# EAGLE design ehomeShades_doit_v2 (EAGLE 8.7.0)
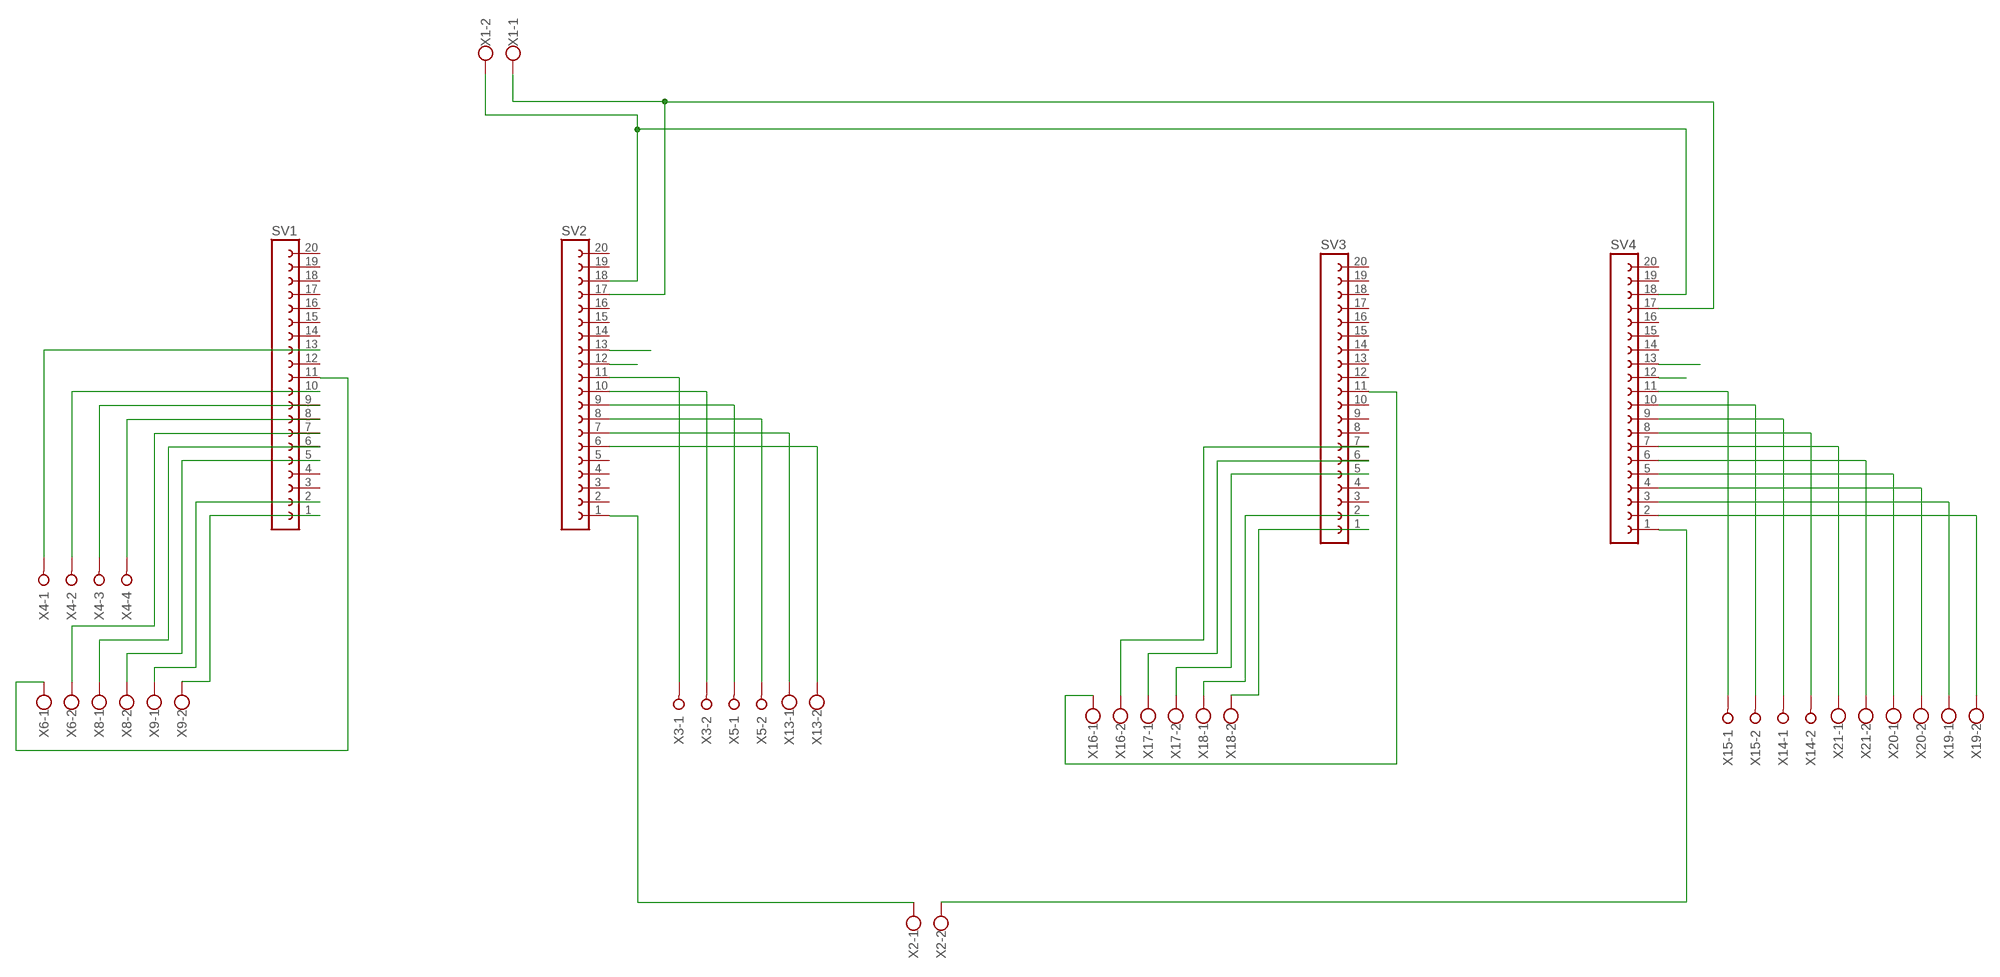
[diagram p0: schematic, sheet 1]

## Parts
SV1  FE20-1  [FE20]
SV2  FE20-1  [FE20]
SV3  FE20-1  [FE20]
SV4  FE20-1  [FE20]
X1  W237-102  [W237-102]
X2  W237-102  [W237-102]
X3  W237-02P  [W237-132]
X4  W237-04P  [W237-4P]
X5  W237-02P  [W237-132]
X6  W237-102  [W237-102]
X8  W237-102  [W237-102]
X9  W237-102  [W237-102]
X13  W237-102  [W237-102]
X14  W237-02P  [W237-132]
X15  W237-02P  [W237-132]
X16  W237-102  [W237-102]
X17  W237-102  [W237-102]
X18  W237-102  [W237-102]
X19  W237-102  [W237-102]
X20  W237-102  [W237-102]
X21  W237-102  [W237-102]

## Nets
EN: SV2.1 X2.1
EN1: SV4.1 X2.2
GND: SV2.17 SV4.17 X1.1
GPIO1: SV4.8 X14.2
GPIO2: SV4.2 X19.2
GPIO3: SV4.3 X19.1
GPIO4: SV1.11 X6.1
GPIO5: SV1.8 X4.4
GPIO6: SV4.4 X20.2
GPIO7: SV4.5 X20.1
GPIO8: SV4.6 X21.2
GPIO9: SV4.7 X21.1
GPIO12: SV2.12
GPIO13: SV2.13
GPIO14: SV2.11 X3.1
GPIO15: SV1.13 X4.1
GPIO16: SV1.10 X4.2
GPIO17: SV1.9 X4.3
GPIO18: SV1.7 X6.2
GPIO19: SV1.6 X8.1
GPIO20: SV3.7 X16.2
GPIO21: SV1.5 X8.2
GPIO22: SV1.2 X9.1
GPIO23: SV1.1 X9.2
GPIO24: SV3.6 X17.1
GPIO25: SV2.8 X5.2
GPIO26: SV2.9 X5.1
GPIO27: SV2.10 X3.2
GPIO28: SV4.9 X14.1
GPIO29: SV4.10 X15.2
GPIO30: SV4.11 X15.1
GPIO31: SV4.13
GPIO32: SV2.6 X13.2
GPIO33: SV2.7 X13.1
GPIO40: SV3.5 X17.2
GPIO41: SV3.2 X18.1
GPIO42: SV3.1 X18.2
GPIO43: SV3.11 X16.1
GPIO44: SV4.12
PWR: SV2.18 SV4.18 X1.2
Unconnected: SV1.3 SV1.4 SV1.12 SV1.14 SV1.15 SV1.16 SV1.17 SV1.18 SV1.19 SV1.20 SV2.2 SV2.3 SV2.4 SV2.5 SV2.14 SV2.15 SV2.16 SV2.19 SV2.20 SV3.3 SV3.4 SV3.8 SV3.9 SV3.10 SV3.12 SV3.13 SV3.14 SV3.15 SV3.16 SV3.17 SV3.18 SV3.19 SV3.20 SV4.14 SV4.15 SV4.16 SV4.19 SV4.20

## Library data of the parts
SV1-SV4 = con-lsta:FE20-1: FEMALE HEADER; OC_FARNELL: unknown; OC_NEWARK: unknown
X1 X2 X6 X8 X9 X13 X16-X21 = con-wago-500:W237-102: WAGO SCREW CLAMP; MPN: 237-102; OC_FARNELL: unknown; OC_NEWARK: 70K9898
X3 X5 X14 X15 = con-wago-508:W237-02P: WAGO SREW CLAMP; OC_FARNELL: unknown; OC_NEWARK: unknown
X4 = con-wago-508:W237-04P: WAGO SREW CLAMP; OC_FARNELL: unknown; OC_NEWARK: unknown

## Board
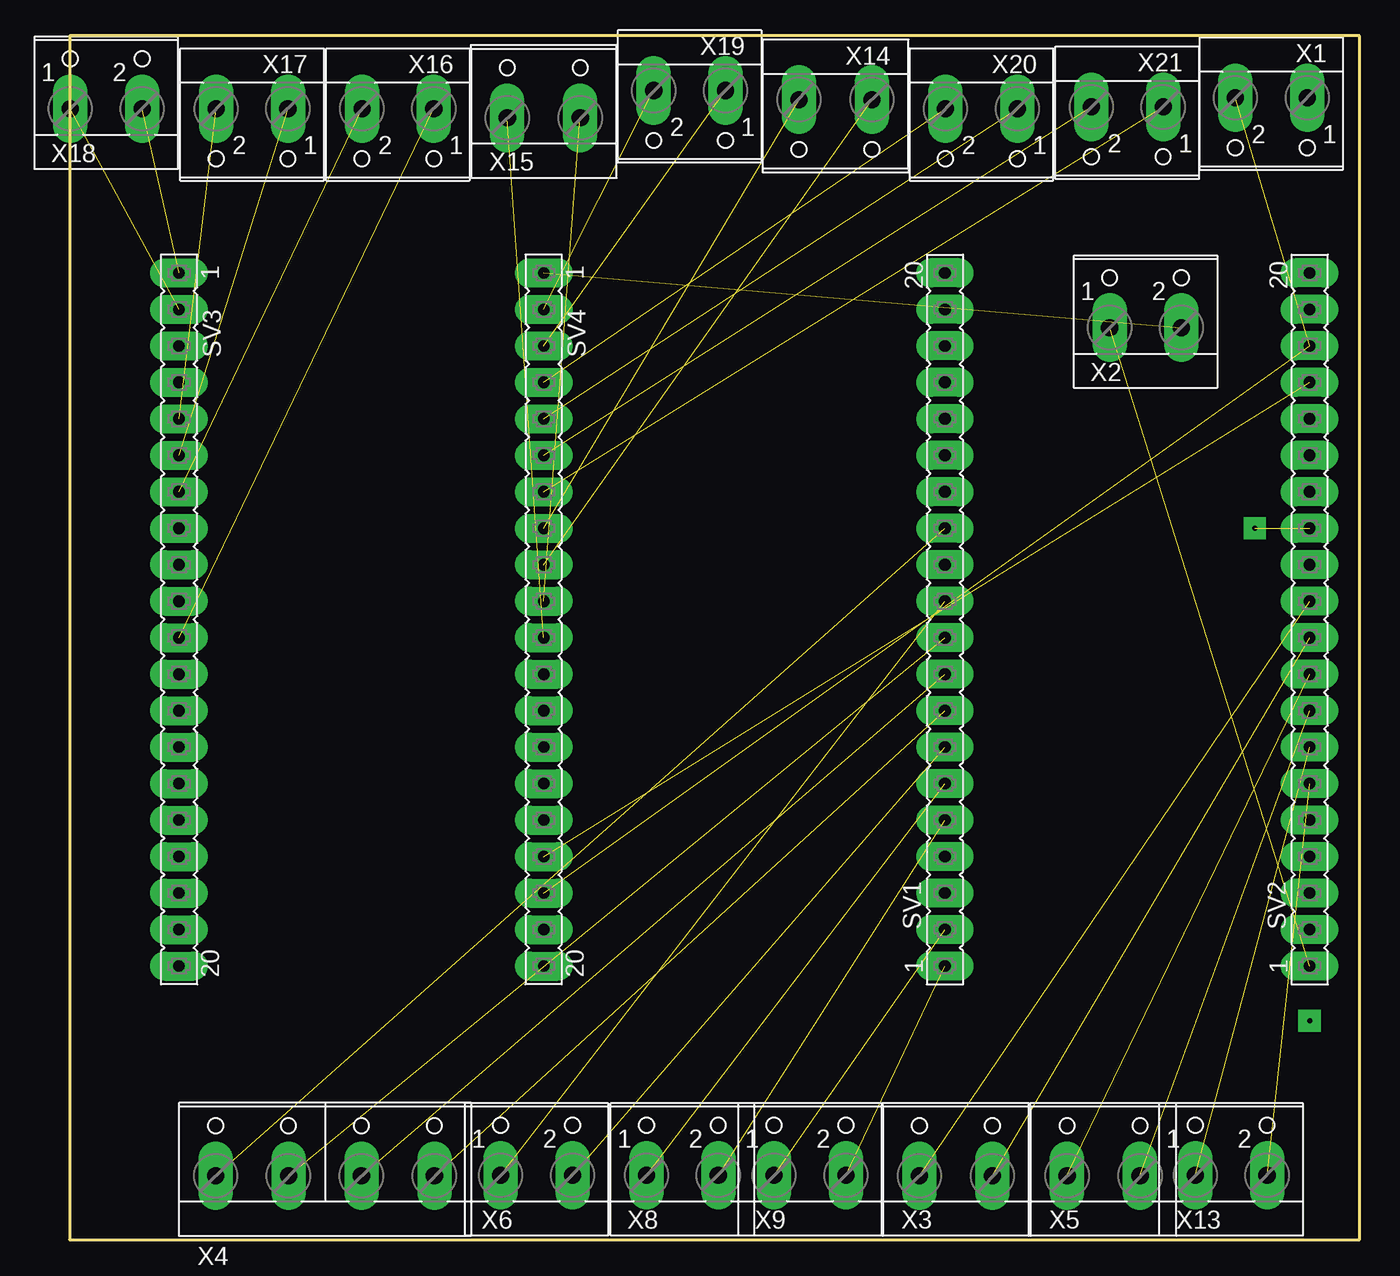
[diagram p1: board, top side]
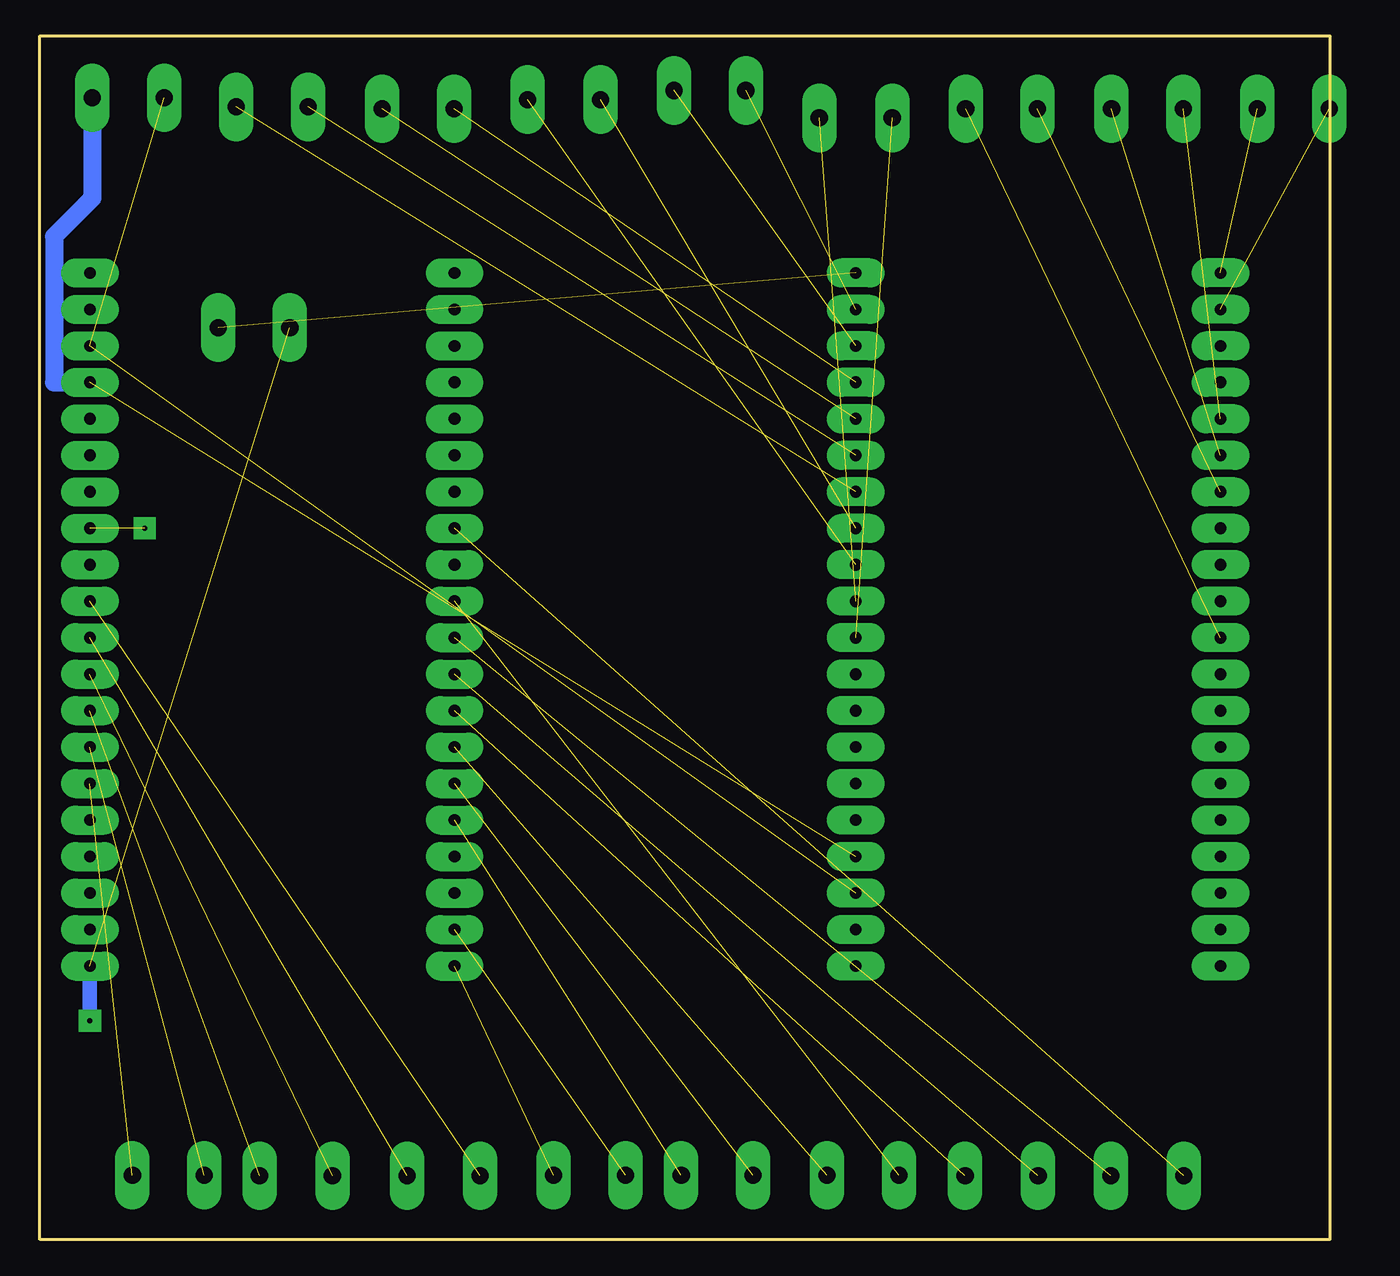
[diagram p2: board, bottom side, seen from below]

Size 89.84 x 83.81 mm. Coordinates in mm from the lower left corner, seen from the top.
Outline: 0,0 89.84,0 89.84,83.81 0,83.81 0,0
Copper layers (1*16): Top 0.035mm / dielectric 1.5mm / Bottom 0.035mm
Design rules "hobby *": minimum track width 1mm, minimum drill 1mm, track to track 0.8mm, track to pad 0.8mm, pad to pad 0.45mm, via to via 0.8mm, smd to smd 8mil, copper to edge 10mil, drill to drill 8mil, minimum pad ring 0.6mm, minimum via ring 0.6mm, stop-mask expansion 0mil, vias tented up to drill 0mil, thermal gap 10mil

### Footprints (pad centres in the part's own frame; a part is rotated, then mirrored left to right if it is on the bottom)
FE20 = drill 0.813 long: 1 -24.13,0; 2 -21.59,0; 3 -19.05,0; 4 -16.51,0; 5 -13.97,0; 6 -11.43,0; 7 -8.89,0; 8 -6.35,0; 9 -3.81,0; 10 -1.27,0; 11 1.27,0; 12 3.81,0; 13 6.35,0; 14 8.89,0; 15 11.43,0; 16 13.97,0; 17 16.51,0; 18 19.05,0; 19 21.59,0; 20 24.13,0
W237-102 = drill 1.194 long: 1 -2.5,-1.27; 2 2.5,-1.27
W237-132 = drill 1.194 long: 1 -2.54,-0.635; 2 2.54,-0.635
W237-4P = drill 1.194 long: 1 -7.62,-0.635; 2 -2.54,-0.635; 3 2.54,-0.635; 4 7.62,-0.635

### Placement (x,y rotation side)
SV1  60.96,43.18 90 top
SV2  86.36,43.18 90 top
SV3  7.62,43.18 270 top
SV4  33.02,43.18 270 top
X1  83.69,78.23 180 top
X2  74.93,64.77 0 top
X3  61.72,5.08 0 top
X4  17.78,5.08 0 top
X5  72.01,5.08 0 top
X6  32.51,5.75 0 top
X8  42.67,5.75 0 top
X9  51.56,5.75 0 top
X13  80.9,5.75 0 top
X14  53.34,78.74 180 top
X15  33.02,78.74 0 top
X16  22.86,77.47 180 top
X17  12.7,77.47 180 top
X18  2.54,80.01 0 top
X19  43.18,78.74 180 top
X20  63.5,77.47 180 top
X21  73.66,77.6 180 top

### Tracks (layer width: path | path; a pad name or v marks a point on that pad's centre or on a via)
EN  (via drill 0.35)  (1 unrouted)
  Bottom 1.016: v86.36,15.24 SV2.1
EN1  (1 unrouted)
GND  (1 unrouted)
  Bottom 1.27: X1.1 86.19,72.51 88.85,69.85 88.85,59.69 SV2.17
GPIO1  (1 unrouted)
GPIO2  (1 unrouted)
GPIO3  (1 unrouted)
GPIO4  (1 unrouted)
GPIO5  (1 unrouted)
GPIO6  (1 unrouted)
GPIO7  (1 unrouted)
GPIO8  (1 unrouted)
GPIO9  (1 unrouted)
GPIO13  (via drill 0.35)  (1 unrouted)
  other vias: 82.55,49.53
GPIO14  (1 unrouted)
GPIO15  (1 unrouted)
GPIO16  (1 unrouted)
GPIO17  (1 unrouted)
GPIO18  (1 unrouted)
GPIO19  (1 unrouted)
GPIO20  (1 unrouted)
GPIO21  (1 unrouted)
GPIO22  (1 unrouted)
GPIO23  (1 unrouted)
GPIO24  (1 unrouted)
GPIO25  (1 unrouted)
GPIO26  (1 unrouted)
GPIO27  (1 unrouted)
GPIO28  (1 unrouted)
GPIO29  (1 unrouted)
GPIO30  (1 unrouted)
GPIO32  (1 unrouted)
GPIO33  (1 unrouted)
GPIO40  (1 unrouted)
GPIO41  (1 unrouted)
GPIO42  (1 unrouted)
GPIO43  (1 unrouted)
PWR  (2 unrouted)

### Text on the board
Bottom: Light Controller doit v2